# Altium schematic sheet 28Pins.SchDoc (part 3 of 3)
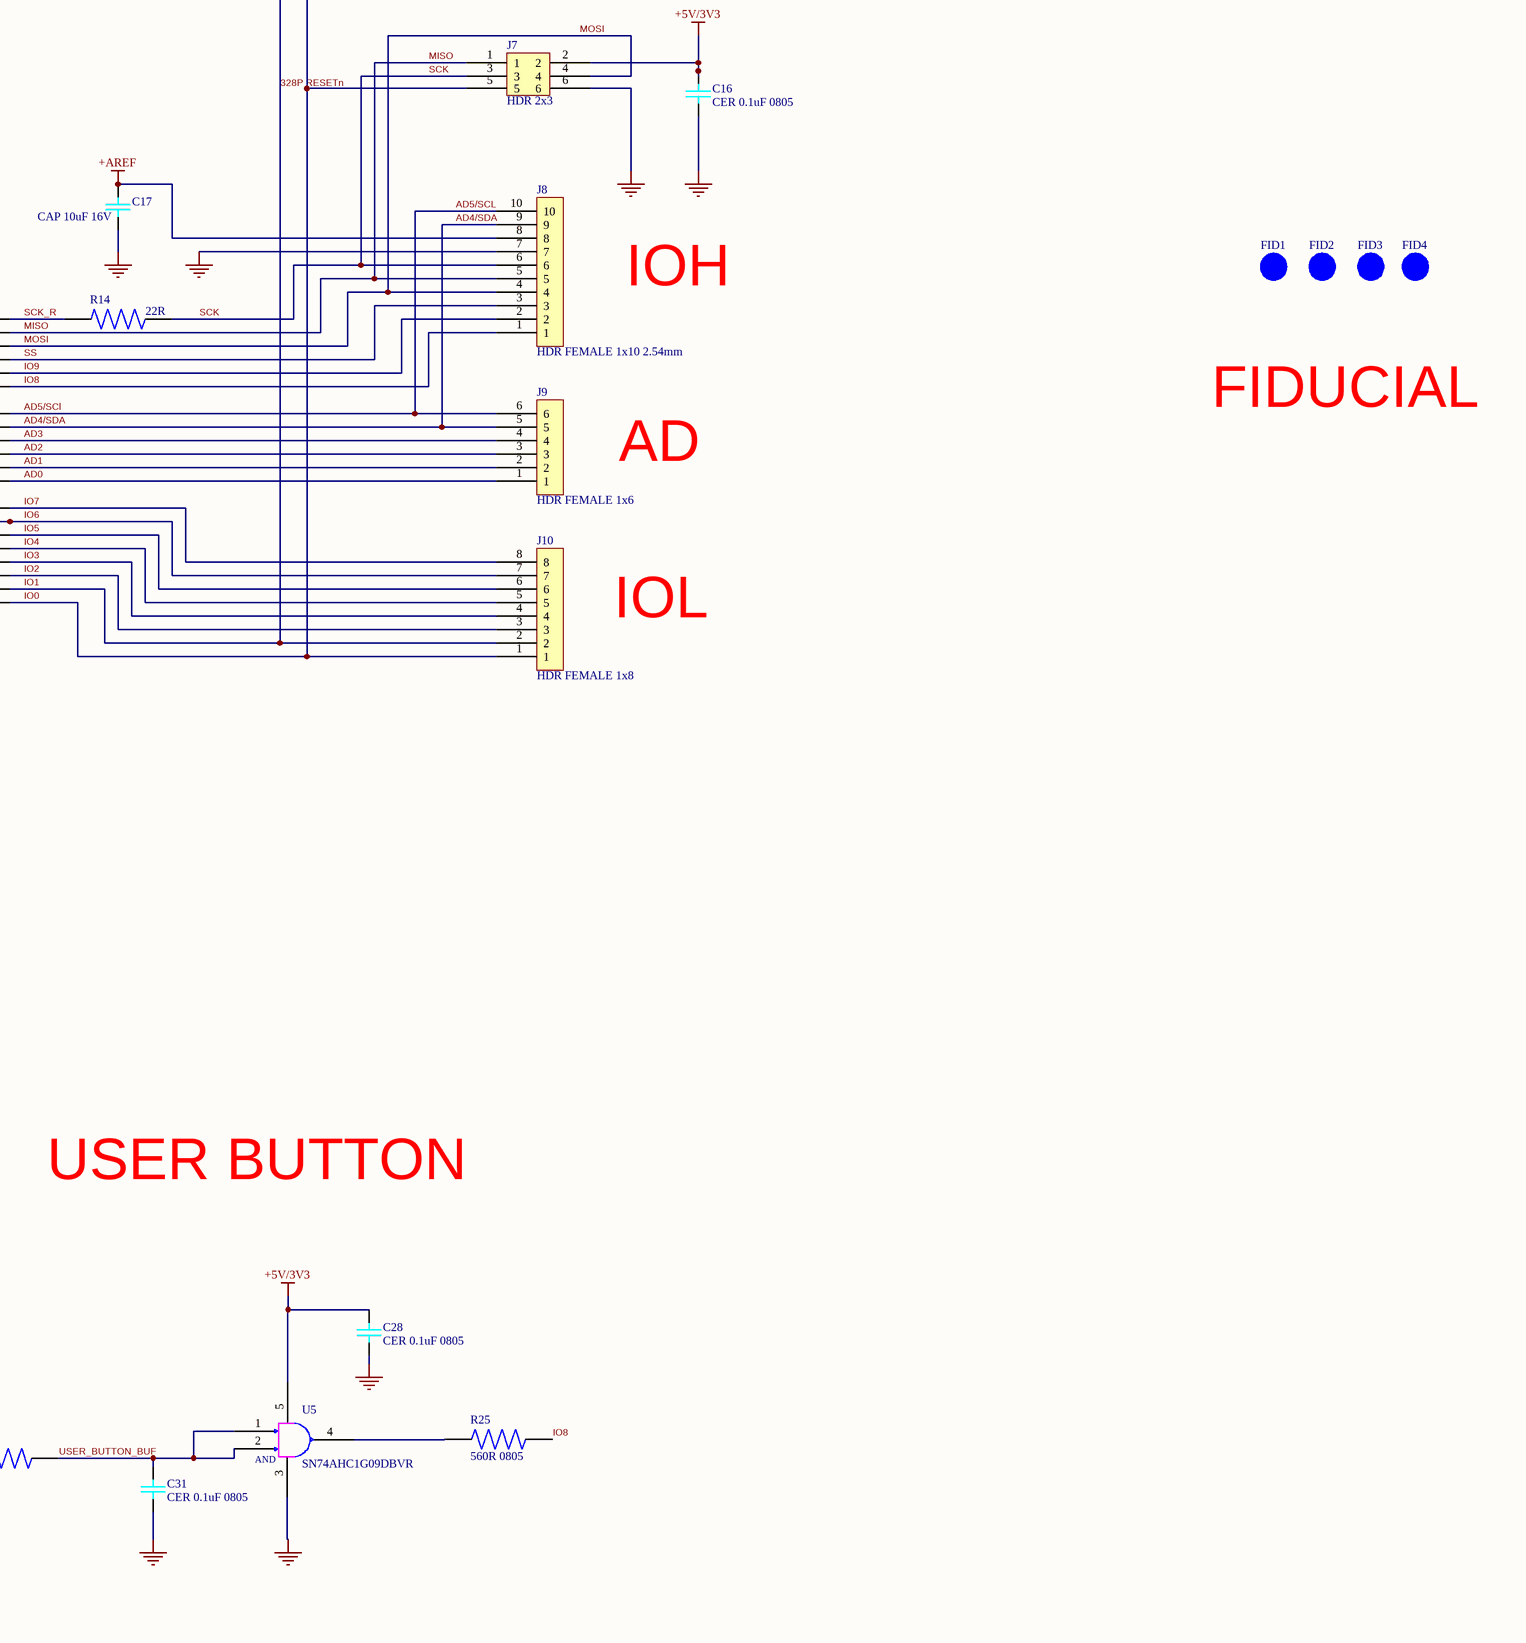
[diagram p7: 28Pins.SchDoc, bottom right]

## Library data of the parts (continued)
Y1 Y2 = ECS-160-S-23A-EN-TR: 16MHz Â±30ppm Crystal Series 60 Ohms 2-SMD, No Lead; MF: ECS Inc.; Package: SMD-2 ECS International; Price: None; MP: ECS-160-S-23A-EN-TR; Availability: Unavailable; SnapEDA_Link: https://www.snapeda.com/parts/ECS-160-S-23A-EN-TR/ECS%20Inc./view-part/2122006/?ref=snap; Value: *; Supplier 1: Digi-Key; Supplier Part Number 1: XC983CT-ND
Z1 Z2 = CG0603MLU-05E: VARISTOR 0603; Manufacturer: Bourns; Capacitance: 0.05pF; Operating Supply Voltage: 5V; Number of Circuits: 1; Clamping Voltage: 25V; Current Rating: 5nA; Response Time: 1ns; Supplier 1: Digi-Key; Manufacturer Part Number: CG0603MLU-05E; RoHS: Yes; Category: Varistors; Stock 1: 2050; Pricing 1: 1=0.43000, 10=0.36000, 25=0.31520, 100=0.27000, 250=0.23400, 500=0.19800, 1000=0.15300, 2500=0.13950 (USD); Mount: Surface Mount; Case/Package: 0603; Number of Pins: 2; Case Code (Metric): 1608; Case Code (Imperial): 0603; Contact Plating: Tin; Min Operating Temperature: -40°C; Max Operating Temperature: 125°C; Package Quantity: 1; Packaging: Tape and Reel; Voltage Rating (DC): 5V; Max Voltage Rating (DC): 5V; Number of Channels: 1; Termination: SMD/SMT; Voltage: 5V; Working Voltage: 5V; Leakage Current: 5nA; Series: MLU; Voltage Rating: 5V; Length: 1.6mm; Width: 0.8mm; Depth: 0.8mm; Radiation Hardening: No; REACH SVHC: No SVHC; RoHS Compliant: Yes; ComponentLink1URL: https://datasheet.ciiva.com/366/mlu-366240.pdf?src-supplier=Digi-Key; ComponentLink1Description: https://datasheet.ciiva.com/366/mlu-366240.pdf?src-supplier=Digi-Key; ComponentLink2URL: https://datasheet.ciiva.com/22696/1785238-22696784.pdf?src-supplier=Element14; ComponentLink2Description: https://datasheet.ciiva.com/22696/1785238-22696784.pdf?src-supplier=Element14; ComponentLink3URL: https://datasheet.ciiva.com/15142/getdatasheetpartid-26780-15142979.pdf?src-supplier=Verical; ComponentLink3Description: https://datasheet.ciiva.com/15142/getdatasheetpartid-26780-15142979.pdf?src-supplier=Verical; ComponentLink4URL: https://datasheet.ciiva.com/11834/0900766b80dbb950-11834607.pdf?src-supplier=RSComponents; ComponentLink4Description: https://datasheet.ciiva.com/11834/0900766b80dbb950-11834607.pdf?src-supplier=RSComponents; ComponentLink5URL: https://datasheet.ciiva.com/10437/mlu-10437034.pdf?src-supplier=Avnet; ComponentLink5Description: https://datasheet.ciiva.com/10437/mlu-10437034.pdf?src-supplier=Avnet; ComponentLink6URL: https://datasheet.ciiva.com/25958/mlu-25958235.pdf?src-supplier=Avnet+Europe; ComponentLink6Description: https://datasheet.ciiva.com/25958/mlu-25958235.pdf?src-supplier=Avnet+Europe; ComponentLink7URL: https://datasheet.ciiva.com/366/mlu-366238.pdf?src-supplier=Digi-Key; ComponentLink7Description: https://datasheet.ciiva.com/366/mlu-366238.pdf?src-supplier=Digi-Key; ComponentLink8URL: https://datasheet.ciiva.com/366/mlu-366239.pdf?src-supplier=Digi-Key; ComponentLink8Description: https://datasheet.ciiva.com/366/mlu-366239.pdf?src-supplier=Digi-Key; Supplier Part Number 1: CG0603MLU-05ECT-ND